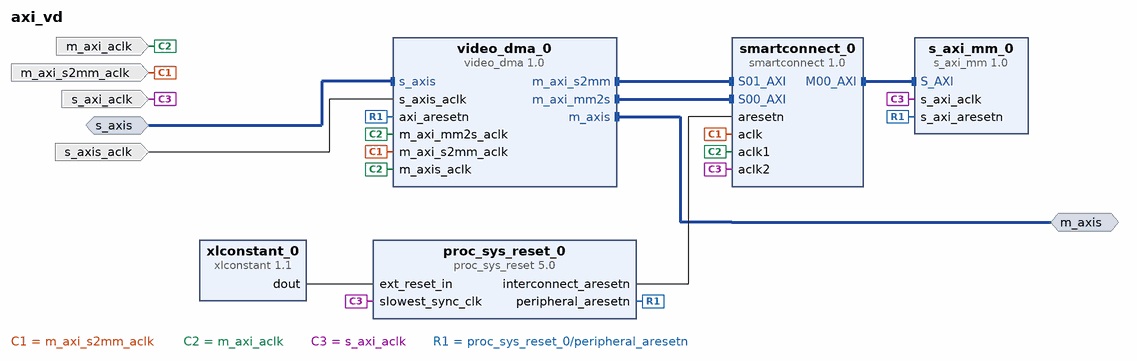
[diagram p0: block diagram of the top level]
# Vivado block design axi_vd, xczu7ev-ffvc1156-2-e, Vivado 2019.1
create_bd_design axi_vd

create_bd_intf_port -mode Master -vlnv xilinx.com:interface:axis_rtl:1.0 m_axis
create_bd_intf_port -mode Slave -vlnv xilinx.com:interface:axis_rtl:1.0 s_axis
set_property -dict [list \
  CONFIG.HAS_TKEEP 0 \
  CONFIG.HAS_TLAST 0 \
  CONFIG.HAS_TREADY 1 \
  CONFIG.HAS_TSTRB 0 \
  CONFIG.LAYERED_METADATA undef \
  CONFIG.TDATA_NUM_BYTES 4 \
  CONFIG.TDEST_WIDTH 0 \
  CONFIG.TID_WIDTH 0 \
  CONFIG.TUSER_WIDTH 0 \
] [get_bd_intf_ports s_axis]
create_bd_port -dir I -type clk s_axis_aclk
create_bd_port -dir I -type clk m_axi_s2mm_aclk
create_bd_port -dir I -type clk m_axi_aclk
create_bd_port -dir I -type clk s_axi_aclk

create_bd_cell -type ip -vlnv xilinx.com:user:s_axi_mm:1.0 s_axi_mm_0
create_bd_cell -type ip -vlnv xilinx.com:ip:smartconnect:1.0 smartconnect_0
set_property -dict {CONFIG.NUM_CLKS 3} [get_bd_cells smartconnect_0]
create_bd_cell -type ip -vlnv xilinx.com:ip:proc_sys_reset:5.0 proc_sys_reset_0
create_bd_cell -type ip -vlnv xilinx.com:ip:xlconstant:1.1 xlconstant_0
create_bd_cell -type ip -vlnv xilinx.com:user:video_dma:1.0 video_dma_0

# ---- connections ----

connect_bd_intf_net [get_bd_intf_pins video_dma_0/m_axi_s2mm] [get_bd_intf_pins smartconnect_0/S01_AXI]
connect_bd_intf_net [get_bd_intf_ports s_axis] [get_bd_intf_pins video_dma_0/s_axis]
connect_bd_intf_net [get_bd_intf_pins smartconnect_0/M00_AXI] [get_bd_intf_pins s_axi_mm_0/S_AXI]
connect_bd_intf_net [get_bd_intf_pins video_dma_0/m_axi_mm2s] [get_bd_intf_pins smartconnect_0/S00_AXI]
connect_bd_intf_net [get_bd_intf_ports m_axis] [get_bd_intf_pins video_dma_0/m_axis]
connect_bd_net -net m_axi_s2mm_aclk_0_1 [get_bd_ports m_axi_s2mm_aclk] [get_bd_pins smartconnect_0/aclk] [get_bd_pins video_dma_0/m_axi_s2mm_aclk]
connect_bd_net -net m_axi_aclk_0_1 [get_bd_ports m_axi_aclk] \
  [get_bd_pins smartconnect_0/aclk1] [get_bd_pins video_dma_0/m_axis_aclk] [get_bd_pins video_dma_0/m_axi_mm2s_aclk]
connect_bd_net [get_bd_ports s_axis_aclk] [get_bd_pins video_dma_0/s_axis_aclk]
connect_bd_net -net s_axi_aclk_0_1 [get_bd_ports s_axi_aclk] \
  [get_bd_pins s_axi_mm_0/s_axi_aclk] [get_bd_pins proc_sys_reset_0/slowest_sync_clk] [get_bd_pins smartconnect_0/aclk2]
connect_bd_net [get_bd_pins xlconstant_0/dout] [get_bd_pins proc_sys_reset_0/ext_reset_in]
connect_bd_net [get_bd_pins proc_sys_reset_0/peripheral_aresetn] [get_bd_pins s_axi_mm_0/s_axi_aresetn] [get_bd_pins video_dma_0/axi_aresetn]
connect_bd_net [get_bd_pins proc_sys_reset_0/interconnect_aresetn] [get_bd_pins smartconnect_0/aresetn]

# ---- address map ----
assign_bd_address -offset 0x40000000 -range 64K -target_address_space [get_bd_addr_spaces video_dma_0/m_axi_mm2s] [get_bd_addr_segs s_axi_mm_0/S_AXI/S_AXI_mem]
assign_bd_address -offset 0x40000000 -range 64K -target_address_space [get_bd_addr_spaces video_dma_0/m_axi_s2mm] [get_bd_addr_segs s_axi_mm_0/S_AXI/S_AXI_mem]

validate_bd_design
save_bd_design
